# Altium project cupmat.PrjPCB
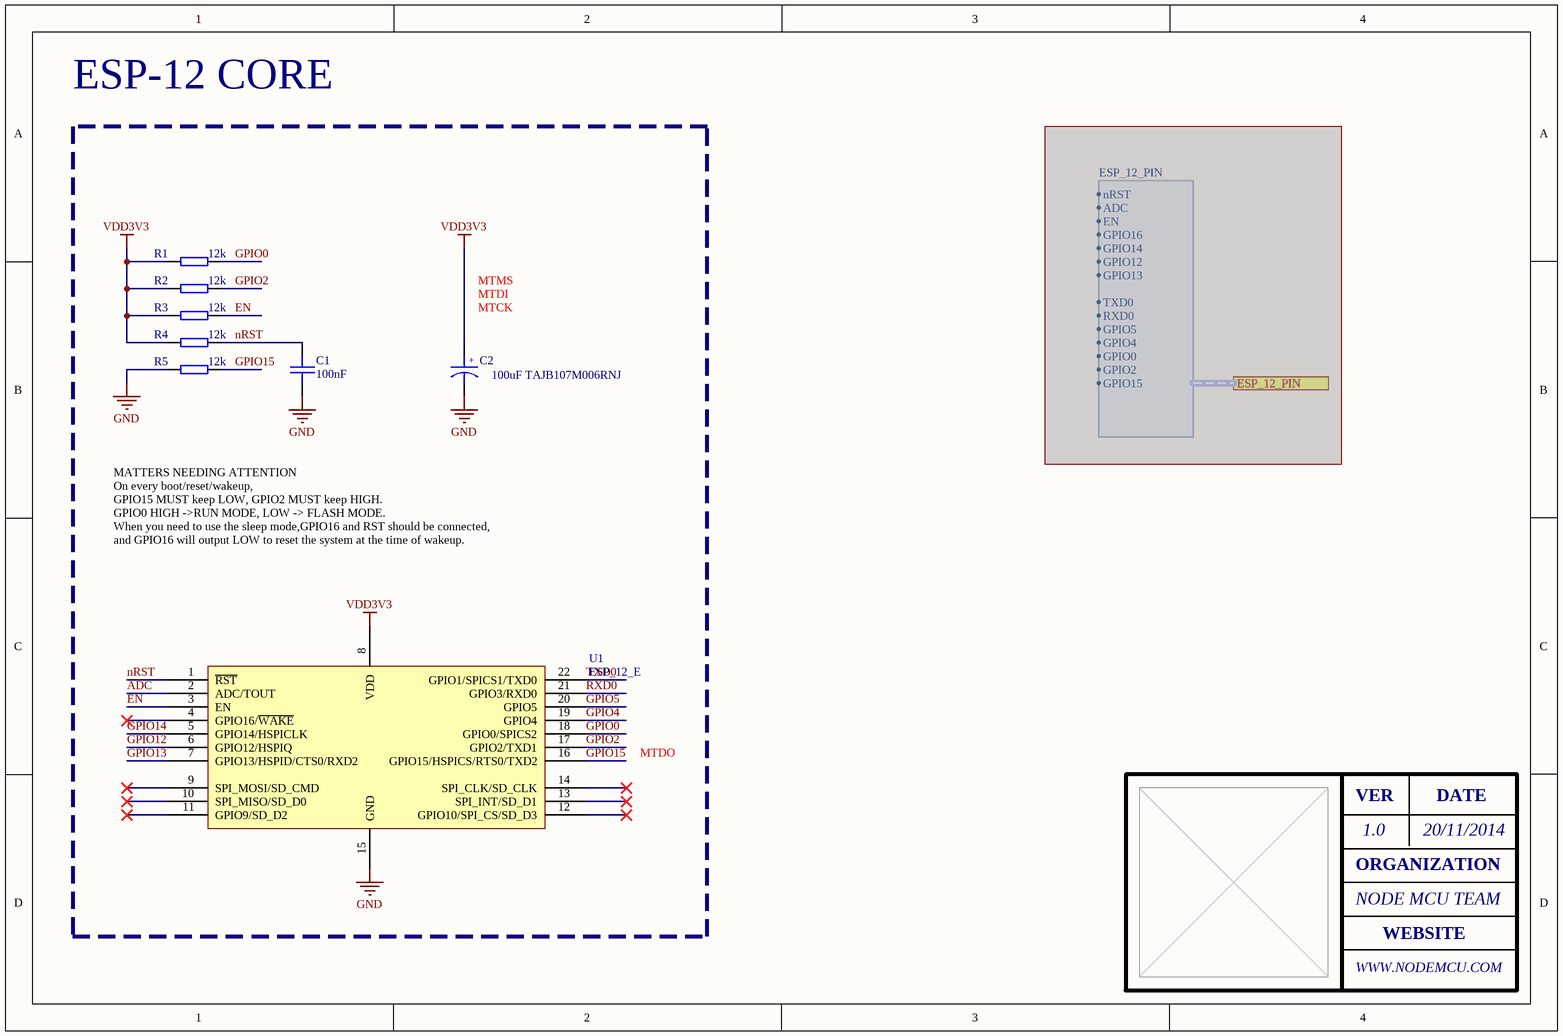
[diagram p0: 02_ESP12_CORE.SchDoc]
6 sheets, 49 parts. Net scope: global (net labels, ports and power ports of the same name join across sheets).
Board file: cupmat.PcbDoc
Sheets:
  02_ESP12_CORE.SchDoc
  03_USB_TO_UART.SchDoc
  04_POWER.SchDoc
  05_IO_CONN.SchDoc
  06_KEY.SchDoc
  08_BATT.SchDoc

## Sheet 02_ESP12_CORE.SchDoc: ESP-12 CORE
size A4; Date: 20/11/2014; Author: HuangRui <vowstar@gmail.com>; DrawnBy: JiYaping <jyp1817@gmail.com>; Organization: WWW.NODEMCU.COM

### Parts
C1  100nF  [SMT_C_0402]
C2  100uF TAJB107M006RNJ  [SMT_C_Tantalum_B]
R1  12k  [SMT_R_0402]
R2  12k  [SMT_R_0402]
R3  12k  [SMT_R_0402]
R4  12k  [SMT_R_0402]
R5  12k  [SMT_R_0402]
U1  ESP_12_E  [ESP_12_E]

### Ports
ESP_12_PIN (harness ESP_12_PIN)

### Harnesses
ESP_12_PIN: nRST, ADC, EN, GPIO16, GPIO12, GPIO13, GPIO14, TXD0, RXD0, GPIO4, GPIO5, GPIO0, GPIO2, GPIO15

### Nets
GND: C1.2 C2.2 R5.1 U1.15(GND)
VDD3V3: C2.1 R1.1 R2.1 R3.1 R4.1 U1.8(VDD)
ADC: U1.2(ADC/TOUT)
EN: R3.2 U1.3(EN)
GPIO0: R1.2 U1.18(GPIO0/SPICS2)
GPIO2: R2.2 U1.17(GPIO2/TXD1)
GPIO4: U1.19(GPIO4)
GPIO5: U1.20(GPIO5)
GPIO12: U1.6(GPIO12/HSPIQ)
GPIO13: U1.7(GPIO13/HSPID/CTS0/RXD2)
GPIO14: U1.5(GPIO14/HSPICLK)
GPIO15: R5.2 U1.16(GPIO15/HSPICS/RTS0/TXD2)
nRST: C1.1 R4.2 U1.1(~{RST})
RXD0: U1.21(GPIO3/RXD0)
TXD0: U1.22(GPIO1/SPICS1/TXD0)

Not connected (* = marked no-connect by the designer): U1 4(GPIO16/~{WAKE})* 9(SPI_MOSI/SD_CMD)* 10(SPI_MISO/SD_D0)* 11(GPIO9/SD_D2)* 12(GPIO10/SPI_CS/SD_D3)* 13(SPI_INT/SD_D1)* 14(SPI_CLK/SD_CLK)*

### Notes on the sheet
- (near C2) MTCK
- MTDI
- MTMS
- MATTERS NEEDING ATTENTION
  On every boot/reset/wakeup,
  GPIO15 MUST keep LOW, GPIO2 MUST keep HIGH.
  GPIO0 HIGH ->RUN MODE, LOW -> FLASH MODE.
  When you need to use the sleep mode,GPIO16 and RST should be connected,
  and GPIO16 will output LOW to reset the system at the time of wakeup.
- MTDO
- VER
- 1.0
- DATE
- ORGANIZATION
- NODE MCU TEAM
- WEBSITE
- (in symbol SMT_C_Tantalum_B) +

### Library data of the parts
C1 = SMT_C_0402: Surface mount capacitor 0402
C2 = SMT_C_Tantalum_B: Capacitor, SM Tantalum; Body 3.5 x 2.8 mm (LxW typ)
R1-R5 = SMT_R_0402: Surface mount resistor 0402
U1 = ESP_12_E: ESP-12 Wi-Fi Module by AI-Thinker; IC: ESP8266-EX; Vendor: Ai-thinker

## Sheet 03_USB_TO_UART.SchDoc: USB TO UART
size A4; Date: 20/11/2014; Author: HuangRui <vowstar@gmail.com>; DrawnBy: JiYaping <jyp1817@gmail.com>; Organization: WWW.NODEMCU.COM
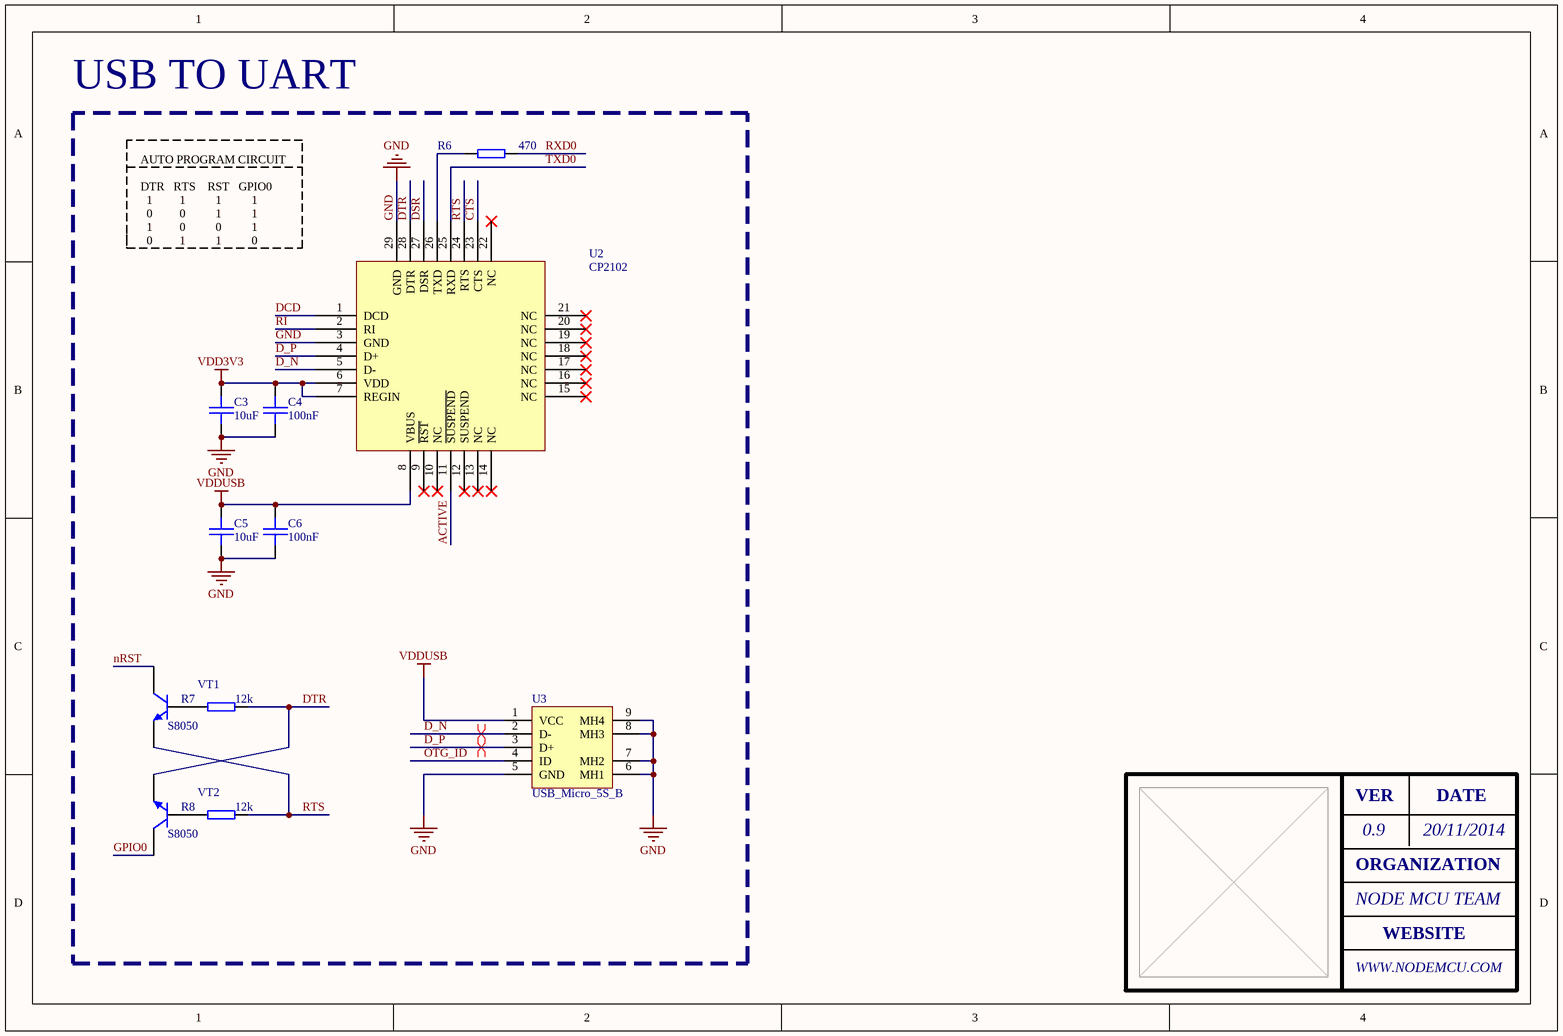
[diagram p1: 03_USB_TO_UART.SchDoc]

### Parts
C3  10uF  [SMT_C_0402]
C4  100nF  [SMT_C_0402]
C5  10uF  [SMT_C_0402]
C6  100nF  [SMT_C_0402]
R6  470  [SMT_R_0402]
R7  12k  [SMT_R_0402]
R8  12k  [SMT_R_0402]
U2  CP2102  [CP2102]
U3  USB_Micro_5S_B  [USB_MICRO_5S_B]
VT1  S8050  [SMT_TRIODE_NPN]
VT2  S8050  [SMT_TRIODE_NPN]

### Nets
GND: C3.2 C4.2 C5.2 C6.2 U2.3(GND) U2.29(GND) U3.5(GND) U3.6(MH1) U3.7(MH2) U3.8(MH3) U3.9(MH4)
VDD3V3: C3.1 C4.1 U2.6(VDD) U2.7(REGIN)
VDDUSB: C5.1 C6.1 U2.8(VBUS) U3.1(VCC)
ACTIVE: U2.11(~{SUSPEND})
CTS: U2.23(CTS)
D_N: U2.5(D-) U3.2(D-)
D_P: U2.4(D+) U3.3(D+)
DCD: U2.1(DCD)
DSR: U2.27(DSR)
DTR: R7.2 U2.28(DTR) VT2.2(E)
GPIO0: VT2.3(C)
nRST: VT1.3(C)
OTG_ID: U3.4(ID)
RI: U2.2(RI)
RTS: R8.2 U2.24(RTS) VT1.2(E)
RXD0: R6.2
TXD0: U2.25(RXD)
NetR6_1: R6.1 U2.26(TXD)
NetR7_1: R7.1 VT1.1(B)
NetR8_1: R8.1 VT2.1(B)

Not connected (* = marked no-connect by the designer): U2 9(~{RST})* 10(NC)* 12(SUSPEND)* 13(NC)* 14(NC)* 15(NC)* 16(NC)* 17(NC)* 18(NC)* 19(NC)* 20(NC)* 21(NC)* 22(NC)*

### Layout directives
differential pair: D_N, D_P

### Notes on the sheet
- AUTO PROGRAM CIRCUIT
  DTR   RTS    RST   GPIO0
  1         1          1          1
  0         0          1          1
  1         0          0          1
  0         1          1          0
- VER
- 0.9
- DATE
- ORGANIZATION
- NODE MCU TEAM
- WEBSITE

### Library data of the parts
C3-C6 = SMT_C_0402: Surface mount capacitor 0402
R6-R8 = SMT_R_0402: Surface mount resistor 0402
U3 = USB_Micro_5S_B: USB micro female SMT with 4 fixed foot
VT1 VT2 = SMT_TRIODE_NPN: Surface mount NPN transistor, package SOT-23

## Sheet 04_POWER.SchDoc: POWER
size A4; Date: 28/01/2015; Author: HuangRui <vowstar@gmail.com>; DrawnBy: JiYaping <jyp1817@gmail.com>; Organization: WWW.NODEMCU.COM
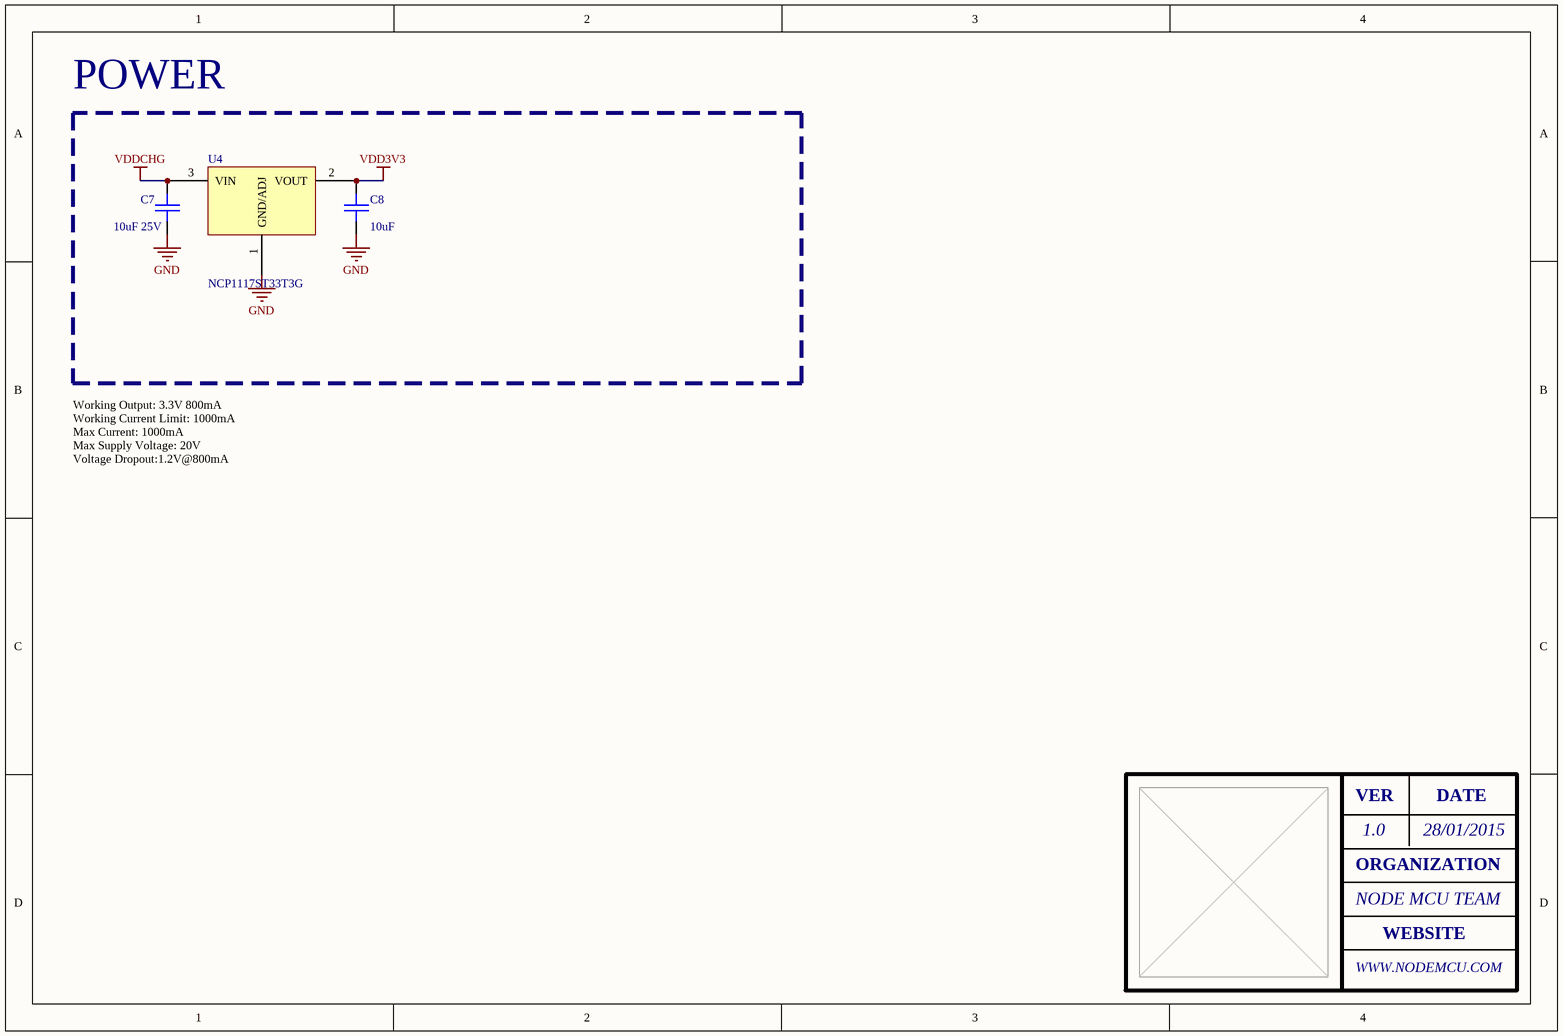
[diagram p2: 04_POWER.SchDoc]

### Parts
C7  10uF 25V  [SMT_C_0805]
C8  10uF  [SMT_C_0402]
U4  NCP1117ST33T3G  [SOT-223]

### Nets
GND: C7.2 C8.2 U4.1(GND/ADJ)
VDD3V3: C8.1 U4.2(VOUT)
VDDCHG: C7.1 U4.3(VIN)

### Notes on the sheet
- Working Output: 3.3V 800mA
  Working Current Limit: 1000mA
  Max Current: 1000mA
  Max Supply Voltage: 20V
  Voltage Dropout:1.2V@800mA
- VER
- 1.0
- DATE
- ORGANIZATION
- NODE MCU TEAM
- WEBSITE

### Library data of the parts
C7 = SMT_C_0805: Surface mount capacitor 0805
C8 = SMT_C_0402: Surface mount capacitor 0402
U4 = NCP1117: NCP1117, NCV1117. 1.0 A Low-Dropout Positive  Fixed and Adjustable  Voltage Regulators

## Sheet 05_IO_CONN.SchDoc: IO CONN
size A4; Date: 20/11/2014; Author: HuangRui <vowstar@gmail.com>; DrawnBy: JiYaping <jyp1817@gmail.com>; Organization: WWW.NODEMCU.COM
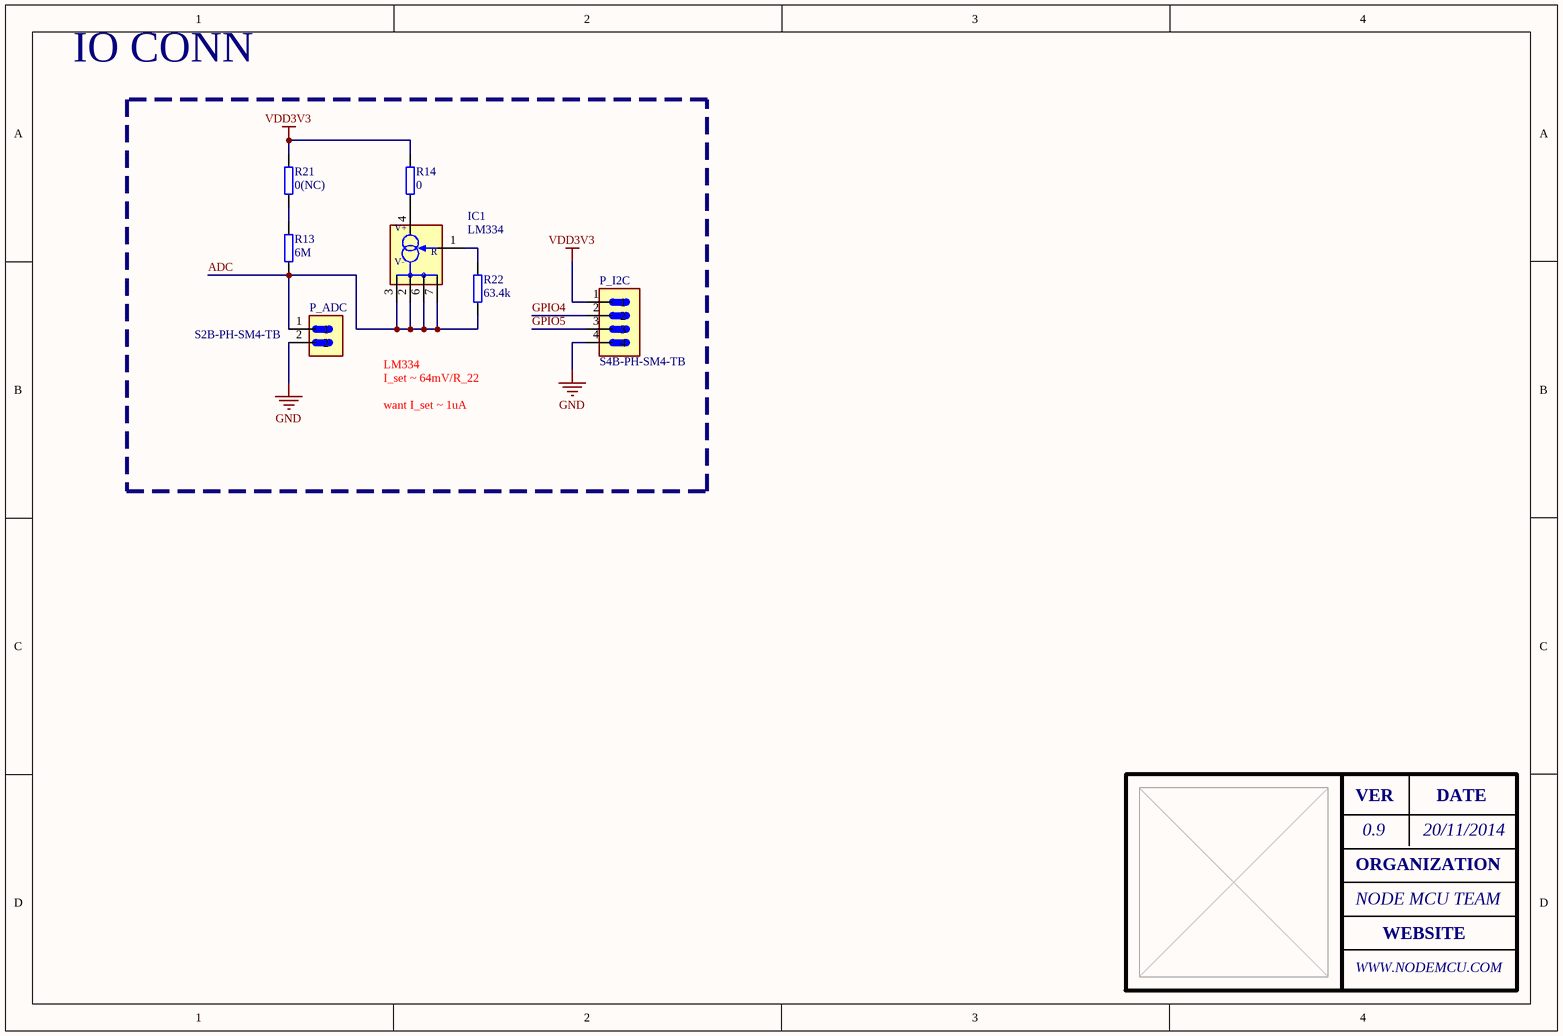
[diagram p3: 05_IO_CONN.SchDoc]

### Parts
IC1  LM334  [SO08]
P_ADC  S2B-PH-SM4-TB  [JST_S2B-PH-SM4-TB]
P_I2C  S4B-PH-SM4-TB  [JST_S4B-PH-SM4-TB]
R13  6M  [SMT_R_0402]
R14  0  [SMT_R_0402]
R21  0(NC)  [SMT_R_0402]
R22  63.4k  [SMT_R_0402]

### Nets
GND: P_ADC.2 P_I2C.4
VDD3V3: P_I2C.1 R14.2 R21.2
ADC: IC1.2(V-) IC1.3(V-@1) IC1.6(V-@2) IC1.7(V-@3) P_ADC.1 R13.1 R22.1
GPIO4: P_I2C.2
GPIO5: P_I2C.3
NetIC1_1: IC1.1(R) R22.2
NetIC1_4: IC1.4(V+) R14.1
NetR13_2: R13.2 R21.1

### Notes on the sheet
- LM334
  I_set ~ 64mV/R_22
  want I_set ~ 1uA
- VER
- 0.9
- DATE
- ORGANIZATION
- NODE MCU TEAM
- WEBSITE

### Library data of the parts
IC1 = LM334: Current Source Regulator Adjustable 8-SOIC; MF: Texas Instruments; SnapEDA_Link: https://www.snapeda.com/parts/LM334/Texas%20Instruments/view-part/681076/?ref=snap; Availability: Unavailable; Price: None; Value: *; MP: LM334; Package: SOIC-8 Texas Instruments
P_ADC = S2B-PH-SM4-TB: Connector Header Surface Mount, Right Angle 2 position 0.079 _2.00mm_; MF: JST Sales; SnapEDA_Link: https://www.snapeda.com/parts/S2B-PH-SM4-TB/JST%20Sales%20America%20Inc./view-part/225866/?ref=snap; Value: *; Price: None; Availability: Unavailable; MP: S2B-PH-SM4-TB; Package: None
P_I2C = S4B-PH-SM4-TB: Connector Header Surface Mount, Right Angle 4 position 0.079 _2.00mm_; MF: JST Sales; Package: None; Value: *; Availability: Unavailable; SnapEDA_Link: https://www.snapeda.com/parts/S4B-PH-SM4-TB/JST%20Sales%20America%20Inc./view-part/473686/?ref=snap; Price: None; MP: S4B-PH-SM4-TB
R13 R14 R21 R22 = SMT_R_0402: Surface mount resistor 0402

## Sheet 06_KEY.SchDoc: KEY
size A4; Date: 20/11/2014; Author: HuangRui <vowstar@gmail.com>; DrawnBy: JiYaping <jyp1817@gmail.com>; Organization: WWW.NODEMCU.COM
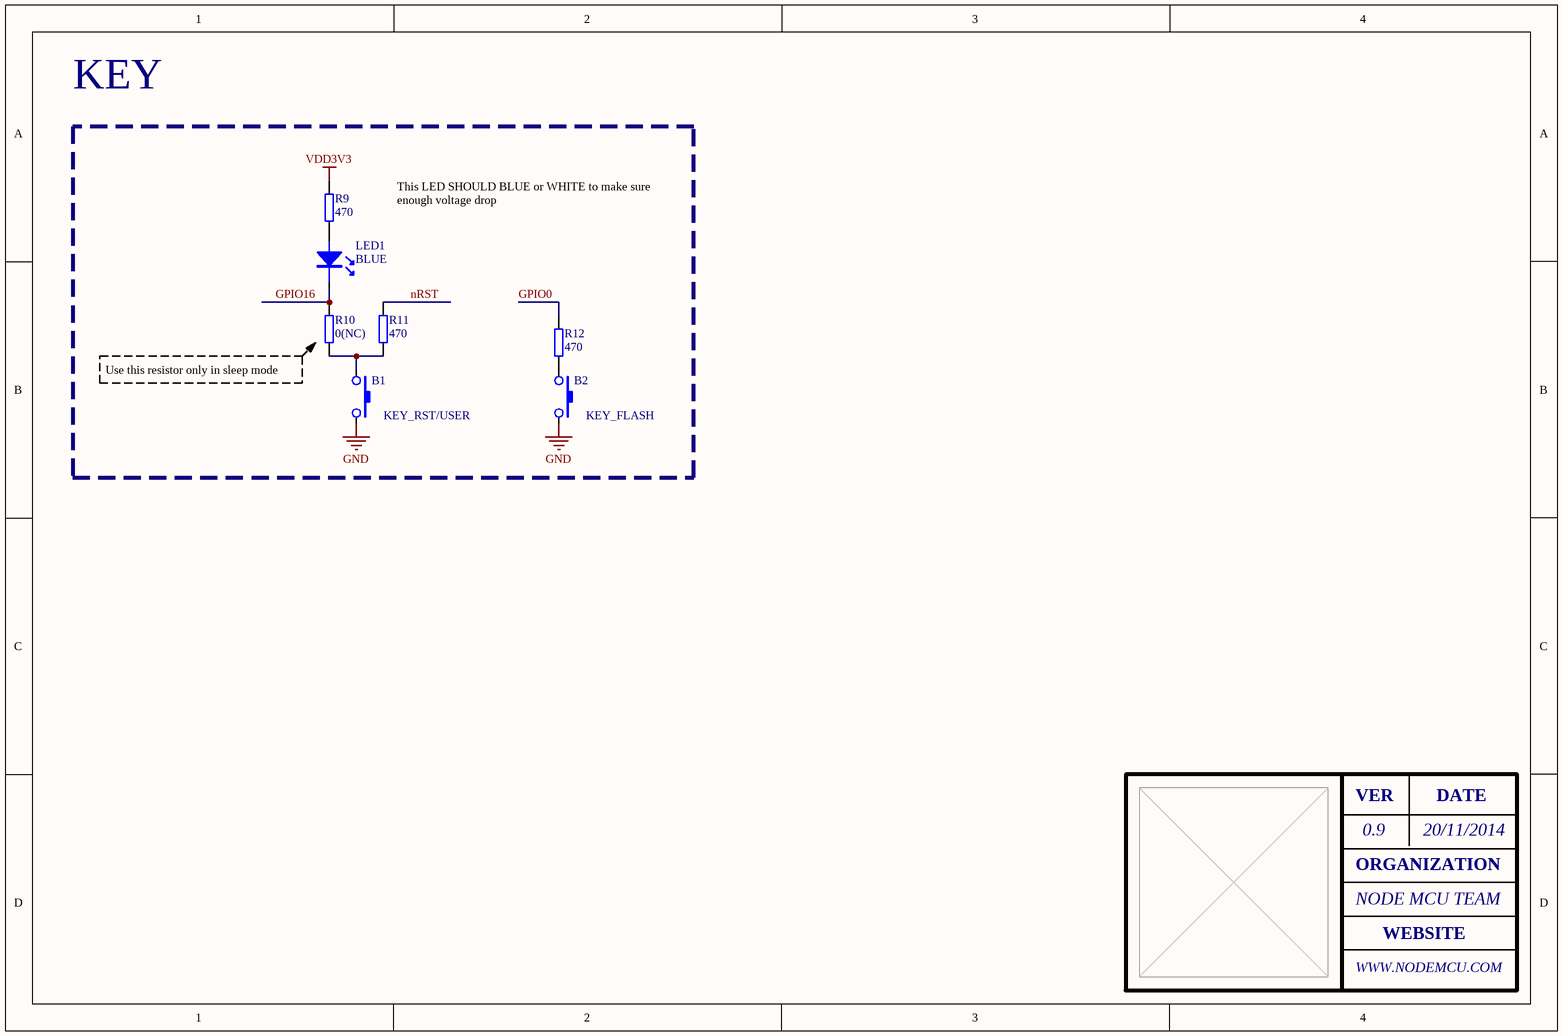
[diagram p4: 06_KEY.SchDoc]

### Parts
B1  KEY_RST/USER  [SMT_SW_PTS_820]
B2  KEY_FLASH  [SMT_SW_PTS_820]
LED1  BLUE  [SMT_LED_0603]
R9  470  [SMT_R_0402]
R10  0(NC)  [SMT_R_0402]
R11  470  [SMT_R_0402]
R12  470  [SMT_R_0402]

### Nets
GND: B1.2 B2.2
VDD3V3: R9.2
GPIO0: R12.2
GPIO16: LED1.2(K) R10.2
nRST: R11.2
NetB1_1: B1.1 R10.1 R11.1
NetB2_1: B2.1 R12.1
NetLED1_1: LED1.1(A) R9.1

### Notes on the sheet
- This LED SHOULD BLUE or WHITE to make sure enough voltage drop
- Use this resistor only in sleep mode
- VER
- 0.9
- DATE
- ORGANIZATION
- NODE MCU TEAM
- WEBSITE

### Library data of the parts
B1 B2 = SMT_SW_PTS_820: SMT Tactile ‎Switch PTS 820 Series
LED1 = SMT_LED_0603: SMT LED
R9-R12 = SMT_R_0402: Surface mount resistor 0402

## Sheet 08_BATT.SchDoc
size A4
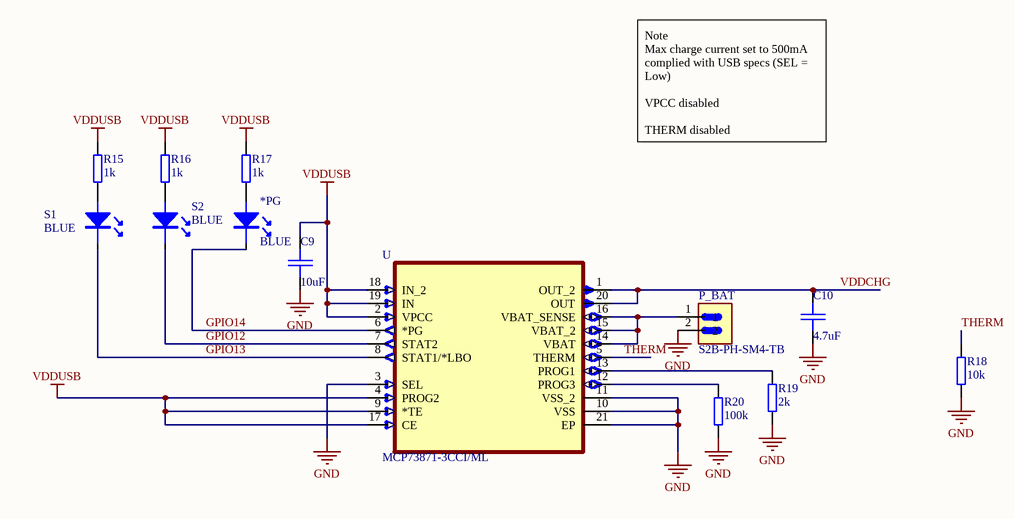
[diagram p5: 08_BATT.SchDoc]

### Parts
*PG  BLUE  [SMT_LED_0603]
C9  10uF  [SMT_C_0402]
C10  4.7uF  [SMT_C_0402]
P_BAT  S2B-PH-SM4-TB  [JST_S2B-PH-SM4-TB]
R15  1k  [SMT_R_0402]
R16  1k  [SMT_R_0402]
R17  1k  [SMT_R_0402]
R18  10k  [SMT_R_0402]
R19  2k  [SMT_R_0402]
R20  100k  [SMT_R_0402]
S1  BLUE  [SMT_LED_0603]
S2  BLUE  [SMT_LED_0603]
U  MCP73871-3CCI/ML  [MCP73871-3CCI/ML]

### Nets
GND: C9.2 C10.2 P_BAT.2 R18.1 R19.1 R20.1 U.3(SEL) U.10(VSS) U.11(VSS_2) U.21(EP)
VDDCHG: C10.1 U.1(OUT_2) U.20(OUT)
VDDUSB: C9.1 R15.2 R16.2 R17.2 U.2(VPCC) U.4(PROG2) U.9(*TE) U.17(CE) U.18(IN_2) U.19(IN)
GPIO12: S2.2(K) U.7(STAT2)
GPIO13: S1.2(K) U.8(STAT1/*LBO)
GPIO14: *PG.2(K) U.6(*PG)
THERM: R18.2 U.5(THERM)
Net*PG_1: *PG.1(A) R17.1
NetP_BAT_1: P_BAT.1 U.14(VBAT) U.15(VBAT_2) U.16(VBAT_SENSE)
NetR15_1: R15.1 S1.1(A)
NetR16_1: R16.1 S2.1(A)
NetR19_2: R19.2 U.13(PROG1)
NetR20_2: R20.2 U.12(PROG3)

### Notes on the sheet
- Note
  Max charge current set to 500mA complied with USB specs (SEL = Low)
  VPCC disabled
  THERM disabled

### Library data of the parts
*PG S1 S2 = SMT_LED_0603: SMT LED
C9 C10 = SMT_C_0402: Surface mount capacitor 0402
P_BAT = S2B-PH-SM4-TB: as P_ADC on sheet 05_IO_CONN; SnapEDA_Link: https://www.snapeda.com/parts/S2B-PH-SM4-TB/JST%20Sales%20America%20Inc./view-part/225866/?ref=snap; Value: *; Price: None; Availability: Unavailable; MP: S2B-PH-SM4-TB; Package: None
R15-R20 = SMT_R_0402: Surface mount resistor 0402
U = MCP73871-3CCI/ML: Charger IC Lithium Ion/Polymer 20-QFN _4x4_; MF: Microchip; MP: MCP73871-3CCI/ML; Package: QFN-20 Microchip; Price: None; Availability: Unavailable; SnapEDA_Link: https://www.snapeda.com/parts/MCP73871-3CCI/ML/Microchip/view-part/276296/?ref=snap; Value: *

## Nets that join several sheets
GND: 02_ESP12_CORE (C1.2 C2.2 R5.1 U1.15), 03_USB_TO_UART (11 pins), 04_POWER (C7.2 C8.2 U4.1), 05_IO_CONN (P_ADC.2 P_I2C.4), 06_KEY (B1.2 B2.2), 08_BATT (10 pins)
VDD3V3: 02_ESP12_CORE (6 pins), 03_USB_TO_UART (C3.1 C4.1 U2.6 U2.7), 04_POWER (C8.1 U4.2), 05_IO_CONN (P_I2C.1 R14.2 R21.2), 06_KEY (R9.2)
VDDCHG: 04_POWER (C7.1 U4.3), 08_BATT (C10.1 U.1 U.20)
VDDUSB: 03_USB_TO_UART (C5.1 C6.1 U2.8 U3.1), 08_BATT (10 pins)
ADC: 02_ESP12_CORE (U1.2), 05_IO_CONN (7 pins)
GPIO0: 02_ESP12_CORE (R1.2 U1.18), 03_USB_TO_UART (VT2.3), 06_KEY (R12.2)
GPIO4: 02_ESP12_CORE (U1.19), 05_IO_CONN (P_I2C.2)
GPIO5: 02_ESP12_CORE (U1.20), 05_IO_CONN (P_I2C.3)
GPIO12: 02_ESP12_CORE (U1.6), 08_BATT (S2.2 U.7)
GPIO13: 02_ESP12_CORE (U1.7), 08_BATT (S1.2 U.8)
GPIO14: 02_ESP12_CORE (U1.5), 08_BATT (*PG.2 U.6)
nRST: 02_ESP12_CORE (C1.1 R4.2 U1.1), 03_USB_TO_UART (VT1.3), 06_KEY (R11.2)
RXD0: 02_ESP12_CORE (U1.21), 03_USB_TO_UART (R6.2)
TXD0: 02_ESP12_CORE (U1.22), 03_USB_TO_UART (U2.25)